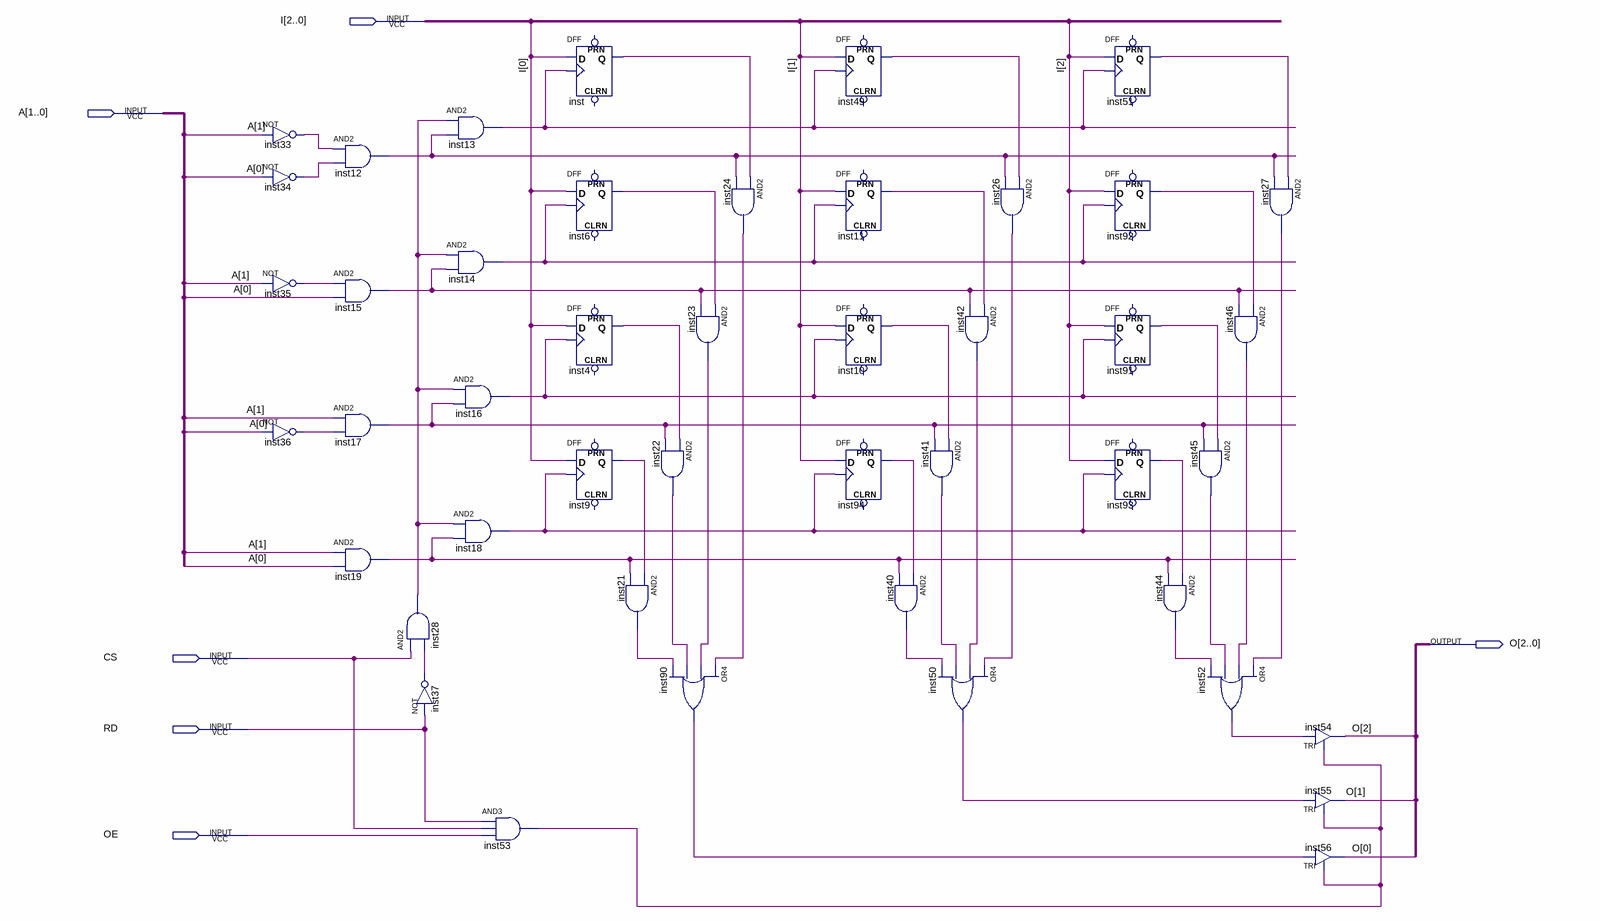
[diagram p0: schematic sheet]
// Quartus schematic memoria.bdf as structural Verilog: 45 symbols, 6 pins
module memoria (
  input  [2:0] I,
  input  [1:0] A,
  input  CS,
  input  RD,
  input  OE,
  output [2:0] O
);

  wire inst4_q, inst6_q, inst9_q, inst10_q, inst11_q, inst12_out, inst13_out, inst14_out, inst15_out,
       inst16_out, inst17_out, inst18_out, inst19_out, inst21_out, inst22_out, inst23_out, inst24_out,
       inst26_out, inst27_out, inst28_out, inst33_out, inst34_out, inst35_out, inst36_out, inst37_out,
       inst40_out, inst41_out, inst42_out, inst44_out, inst45_out, inst46_out, inst49_q, inst50_out,
       inst51_q, inst52_out, inst53_out, inst90_out, inst91_q, inst92_q, inst93_q, inst94_q, inst_q;

  not inst33 (inst33_out, A[1]);
  not inst34 (inst34_out, A[0]);
  not inst35 (inst35_out, A[1]);
  not inst36 (inst36_out, A[0]);
  and inst12 (inst12_out, inst33_out, inst34_out);
  and inst15 (inst15_out, inst35_out, A[0]);
  and inst17 (inst17_out, A[1], inst36_out);
  and inst19 (inst19_out, A[1], A[0]);
  and inst28 (inst28_out, CS, inst37_out);
  and inst13 (inst13_out, inst28_out, inst12_out);
  and inst14 (inst14_out, inst28_out, inst15_out);
  and inst16 (inst16_out, inst28_out, inst17_out);
  and inst18 (inst18_out, inst28_out, inst19_out);
  not inst37 (inst37_out, RD);
  and inst53 (inst53_out, RD, CS, OE);
  DFF inst (.CLK(inst13_out), .D(I[0]), .Q(inst_q));  // open: CLRN, PRN
  DFF inst6 (.CLK(inst14_out), .D(I[0]), .Q(inst6_q));  // open: CLRN, PRN
  DFF inst4 (.CLK(inst16_out), .D(I[0]), .Q(inst4_q));  // open: CLRN, PRN
  DFF inst9 (.CLK(inst18_out), .D(I[0]), .Q(inst9_q));  // open: CLRN, PRN
  and inst21 (inst21_out, inst9_q, inst19_out);
  and inst23 (inst23_out, inst6_q, inst15_out);
  and inst22 (inst22_out, inst4_q, inst17_out);
  or inst90 (inst90_out, inst24_out, inst23_out, inst22_out, inst21_out);
  and inst24 (inst24_out, inst_q, inst12_out);
  DFF inst49 (.CLK(inst13_out), .D(I[1]), .Q(inst49_q));  // open: CLRN, PRN
  DFF inst11 (.CLK(inst14_out), .D(I[1]), .Q(inst11_q));  // open: CLRN, PRN
  DFF inst10 (.CLK(inst16_out), .D(I[1]), .Q(inst10_q));  // open: CLRN, PRN
  DFF inst94 (.CLK(inst18_out), .D(I[1]), .Q(inst94_q));  // open: CLRN, PRN
  and inst40 (inst40_out, inst94_q, inst19_out);
  and inst42 (inst42_out, inst11_q, inst15_out);
  and inst41 (inst41_out, inst10_q, inst17_out);
  or inst50 (inst50_out, inst26_out, inst42_out, inst41_out, inst40_out);
  and inst26 (inst26_out, inst49_q, inst12_out);
  DFF inst51 (.CLK(inst13_out), .D(I[2]), .Q(inst51_q));  // open: CLRN, PRN
  DFF inst92 (.CLK(inst14_out), .D(I[2]), .Q(inst92_q));  // open: CLRN, PRN
  DFF inst91 (.CLK(inst16_out), .D(I[2]), .Q(inst91_q));  // open: CLRN, PRN
  DFF inst93 (.CLK(inst18_out), .D(I[2]), .Q(inst93_q));  // open: CLRN, PRN
  and inst45 (inst45_out, inst91_q, inst17_out);
  and inst44 (inst44_out, inst93_q, inst19_out);
  or inst52 (inst52_out, inst27_out, inst46_out, inst45_out, inst44_out);
  and inst46 (inst46_out, inst92_q, inst15_out);
  and inst27 (inst27_out, inst51_q, inst12_out);
  TRI inst54 (.IN(inst52_out), .OE(inst53_out), .OUT(O[2]));
  TRI inst55 (.IN(inst50_out), .OE(inst53_out), .OUT(O[1]));
  TRI inst56 (.IN(inst90_out), .OE(inst53_out), .OUT(O[0]));
endmodule
